# Altium schematic sheet SchematicAltiumdesigner.schdoc
size 175 x 63 mm
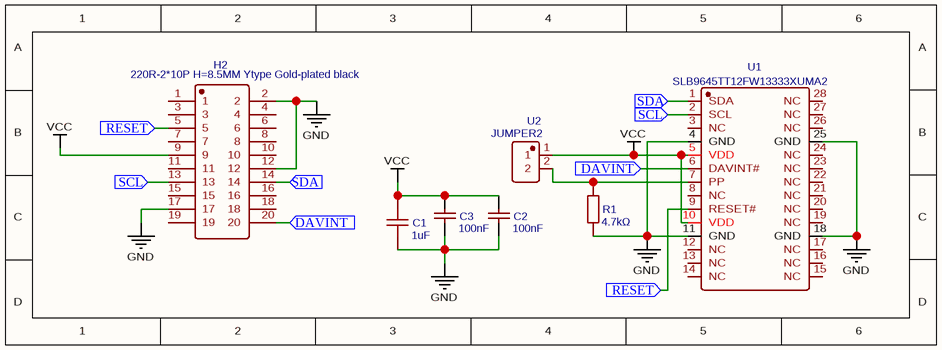
[diagram p0: SchematicAltiumdesigner.schdoc]

## Parts
C1  1uF  [C1206]
C2  100nF  [C1206]
C3  100nF  [C1206]
H2  220R-2*10P H=8.5MM Ytype Gold-plated black  [HDR-TH_20P-P2.54-H-F-R2-C10-S2.54-W10.2]
R1  4.7kΩ  [R1206]
U1  SLB9645TT12FW13333XUMA2  [PG-TSSOP-28_L9.7-W4.4-P0.65-LS6.4-BL]
U2  JUMPER2  [HDR-TH_2P-P2.54-V-M-1]

## Ports
DAVINT (in), RESET (in), SCL (in), SDA (in)

## Nets
GND: C1.1 C2.1 C3.1 H2.2 H2.12 H2.17 R1.2 U1.4(GND) U1.11(GND) U1.18(GND) U1.25(GND)
VCC: C1.2 C2.2 C3.2 H2.9 U1.5(VDD) U1.10(VDD) U2.1
DAVINT: H2.20 U1.6(DAVINT#) ; port DAVINT
RESET: H2.5 U1.9(RESET#) ; port RESET
SCL: H2.13 U1.2(SCL) ; port SCL
SDA: H2.14 U1.1(SDA) ; port SDA
NetR1_1: R1.1 U1.7(PP) U2.2

Not connected (* = marked no-connect by the designer): H2 1 3 4 6 7 8 10 11 15 16 18 19; U1 3(NC) 8(NC) 12(NC) 13(NC) 14(NC) 15(NC) 16(NC) 17(NC) 19(NC) 20(NC) 21(NC) 22(NC) 23(NC) 24(NC) 26(NC) 27(NC) 28(NC)

## Library data of the parts
C1 = 1uF: BOM_Manufacturer: SAMSUNG; BOM_Manufacturer Part: CL31B105KBHNNNE; nameAlias: Capacitance; BOM_Supplier: LCSC; BOM_Supplier Part: C1848; BOM_JLCPCB Part Class: Basic Part; spicePre: C; spiceSymbolName: CL31B105KBHNNNE
C2 C3 = 100nF: BOM_Manufacturer Part: CL31B104KBCNNNC; BOM_Manufacturer: SAMSUNG; nameAlias: Capacitance; BOM_Supplier: LCSC; BOM_Supplier Part: C24497; BOM_JLCPCB Part Class: Basic Part; spicePre: C; spiceSymbolName: CL31B104KBCNNNC
H2 = 220R-2*10P H=8.5MM Ytype Gold-plated black: BOM_Manufacturer: Ckmtw; Contributor: LCSC; BOM_Supplier: LCSC; BOM_Manufacturer Part: 220R-2*10P H=8.5MM Ytype Gold-plated black; BOM_Supplier Part: C124406; BOM_JLCPCB Part Class: Extended Part; spicePre: H; spiceSymbolName: 220R-2*10P H=8.5MM Ytype Gold-plated black
R1 = 4.7kΩ: BOM_Manufacturer: Tyohm; BOM_Manufacturer Part: RMC12064.7K5%N; Resistance (Ohms): 4.7K; nameAlias: Resistance; Contributor: LCSC; BOM_Supplier: LCSC; BOM_Supplier Part: C269760; BOM_JLCPCB Part Class: Extended Part; spicePre: R; spiceSymbolName: RMC12064.7K5%N
U1 = SLB9645TT12FW13333XUMA2: BOM_Manufacturer: Infineon(英飞凌); Contributor: lcsc; BOM_Supplier: LCSC; BOM_Supplier Part: C2651707; BOM_Manufacturer Part: SLB9645TT12FW13333XUMA2; link: https://atta.szlcsc.com/upload/public/pdf/source/20210702/EA1C2EE47819950D139826A081C2097F.pdf; spicePre: U; spiceSymbolName: SLB9645TT12FW13333XUMA2
U2 = JUMPER2: BOM_Manufacturer: null; Contributor: LCSC; BOM_Supplier: LCSC; BOM_Supplier Part: C2940092; BOM_Manufacturer Part: Jumper2; BOM_JLCPCB Part Class: Extended Part; spicePre: U; spiceSymbolName: JUMPER2